# EAGLE design omni (EAGLE 9.2.0)
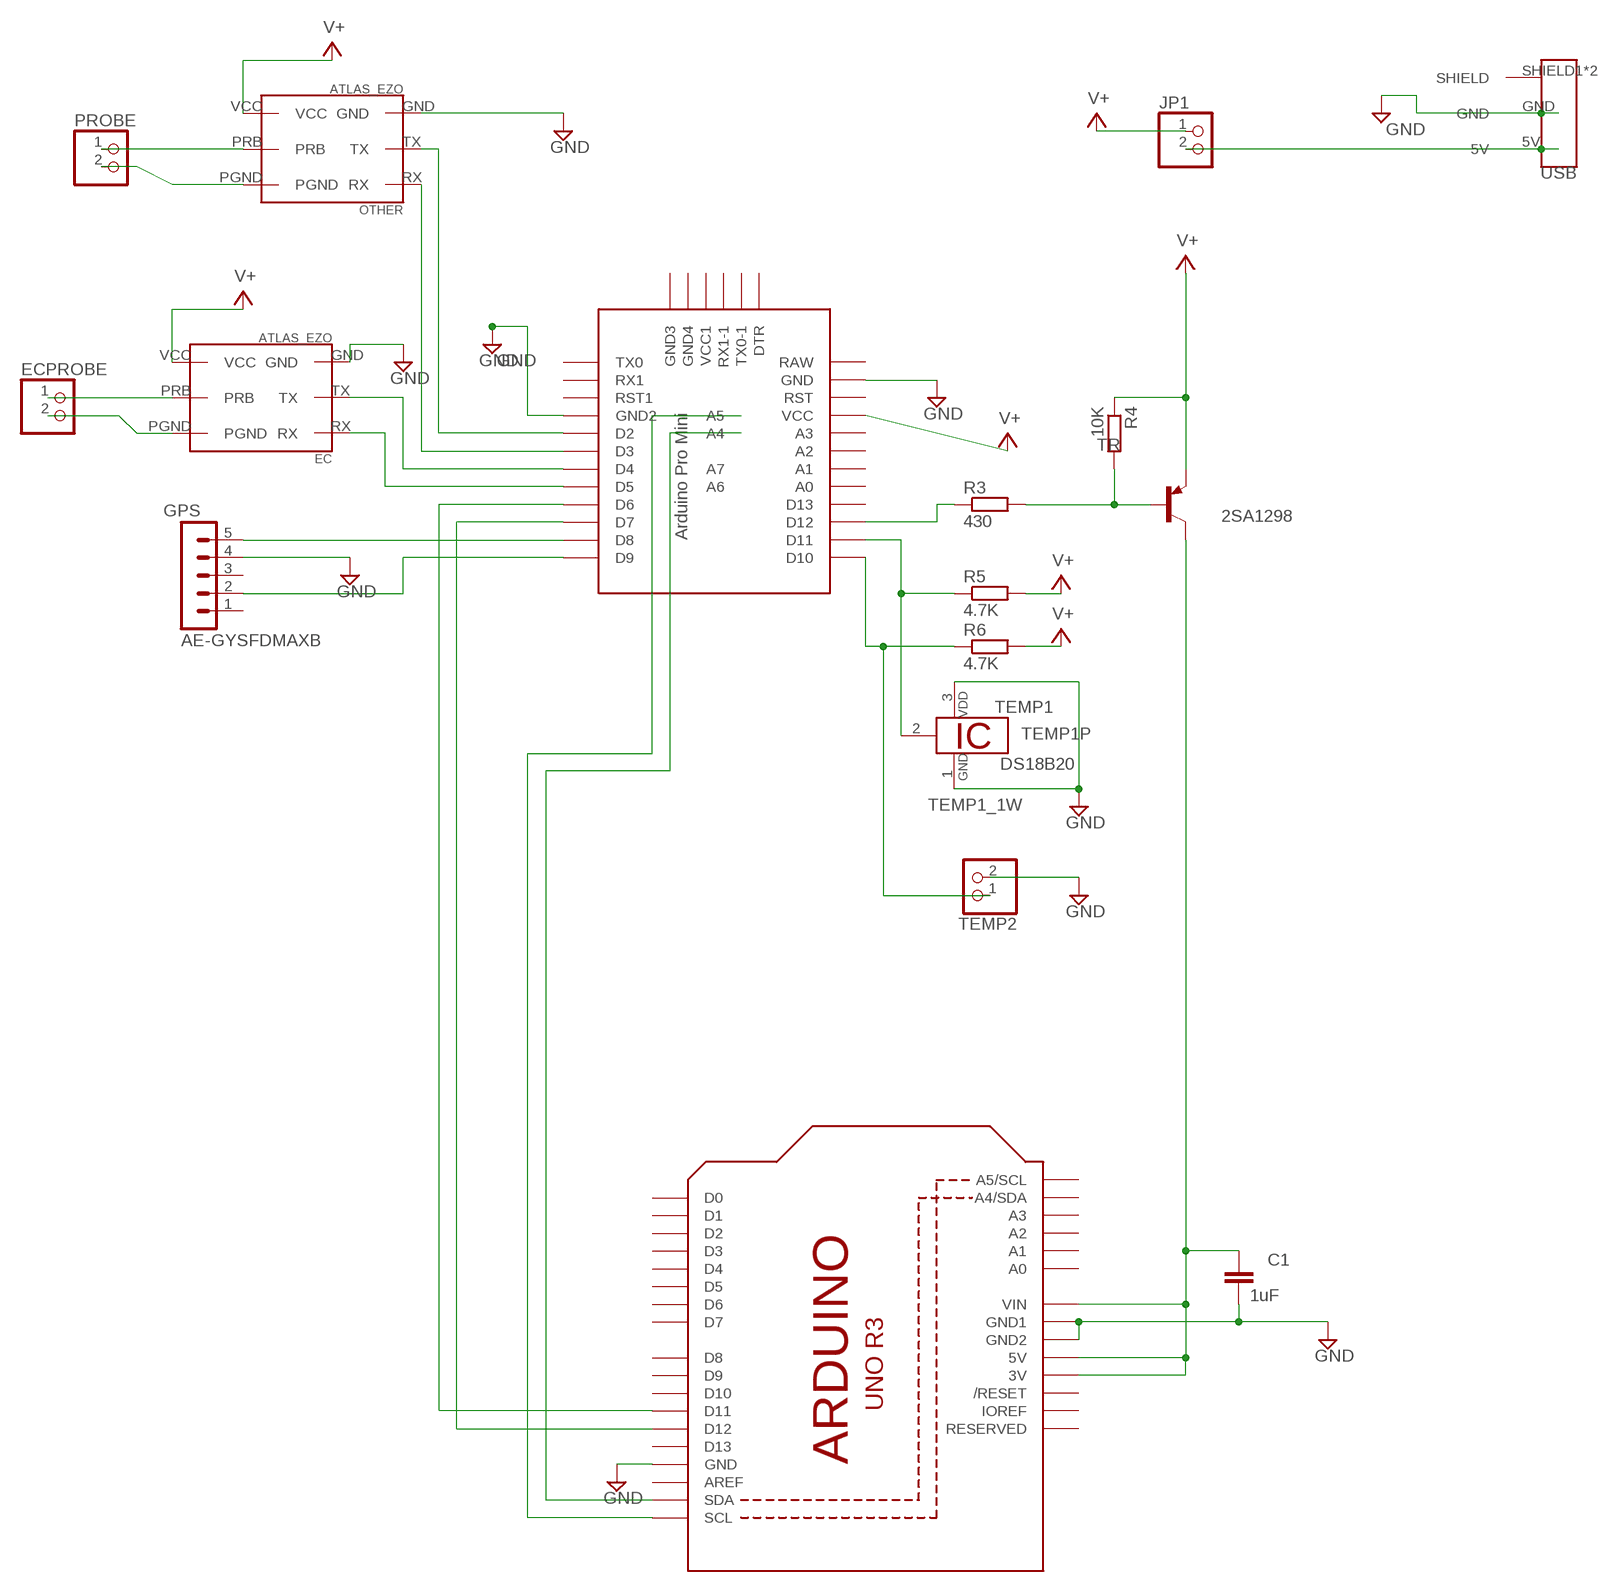
[diagram p0: schematic, sheet 1]

## Parts
C1  1uF  C-EUC2012  [C2012]
EC  ATLAS_EZO  [ATLAS_EZO]
ECPROBE  PINHD-1X2  [1X02]
GPS  AE-GYSFDMAXB  GPSAKITSUKI  [MA05-1]
JP1  PINHD-1X2  [1X02]
LTE_LORA  ARDUINOR3-BPLACE  [ARDUINOR3-BPLACE]
OTHER  ATLAS_EZO  [ATLAS_EZO]
PROBE  PINHD-1X2  [1X02]
R3  430  R-EU_M2012  [M2012]
R4  10K  R-EU_M2012  [M2012]
R5  4.7K  R-EU_M2012  [M2012]
R6  4.7K  R-EU_M2012  [M2012]
TEMP1  DS18B20  [TO92-]
TEMP2  PINHD-1X2  [1X02]
TR  2SA1298  BF823SMD  [SOT23-BEC]
U$1  PRO-MINI-2  [PRO-MINI-2]
USB  MICROUSBCON  [MICROUSBCON]

## Nets
GND: C1.2 EC.GND GPS.4(GND) LTE_LORA.GND LTE_LORA.GND1 LTE_LORA.GND2 OTHER.GND TEMP1.1 TEMP1.3 TEMP2.2 U$1.GND U$1.GND1(GND2) USB.GND
N$1: GPS.2 U$1.D9
N$2: GPS.5(5V) U$1.D8
N$3: EC.RX U$1.D5
N$4: C1.1 LTE_LORA.3V LTE_LORA.5V LTE_LORA.VIN TR.C
N$5: R3.1 U$1.D12
N$6: EC.TX U$1.D4
N$7: R3.2 R4.2 TR.B
N$8: OTHER.RX U$1.D3
N$9: R6.1 TEMP2.1 U$1.D10
N$10: R5.1 TEMP1.2 U$1.D11
N$11: OTHER.TX U$1.D2
N$12: JP1.2 USB.5V
N$13: LTE_LORA.SDA U$1.A4
N$14: LTE_LORA.SCL U$1.A5
N$15: LTE_LORA.D12 U$1.D7
N$16: LTE_LORA.D11 U$1.D6
N$17: EC.PRB ECPROBE.1
N$18: EC.PGND ECPROBE.2
N$19: OTHER.PRB PROBE.1
N$20: OTHER.PGND PROBE.2
V+: EC.VCC JP1.1 OTHER.VCC R4.1 R5.2 R6.2 TR.E U$1.VCC
Unconnected: GPS.1 GPS.3 LTE_LORA.A0 LTE_LORA.A1 LTE_LORA.A2 LTE_LORA.A3 LTE_LORA.A4(A4/SDA) LTE_LORA.A5(A5/SCL) LTE_LORA.AREF LTE_LORA.D0 LTE_LORA.D1 LTE_LORA.D2 LTE_LORA.D3 LTE_LORA.D4 LTE_LORA.D5 LTE_LORA.D6 LTE_LORA.D7 LTE_LORA.D8 LTE_LORA.D9 LTE_LORA.D10 LTE_LORA.D13 LTE_LORA.IOREF LTE_LORA.RESERVED LTE_LORA.RESET(/RESET) U$1.A0 U$1.A1 U$1.A2 U$1.A3 U$1.A6 U$1.A7 U$1.D13 U$1.DTR U$1.GND2(GND3) U$1.GND3(GND4) U$1.RAW U$1.RST U$1.RST1 U$1.RX1 U$1.RX1-1 U$1.TX0 U$1.TX0-1 U$1.VCC1 USB.SHIELD1(SHIELD) USB.SHIELD2(SHIELD)

## Library data of the parts
C1 = rcl:C-EU: CAPACITOR, European symbol; SPICEPREFIX: C
EC OTHER = AtlasScientific:ATLAS_EZO: Atlas Scientific EZO Circuit
ECPROBE JP1 PROBE TEMP2 = pinhead:PINHD-1X2: PIN HEADER
GPS = OMNI:GPSAKITSUKI: GPS MODULE; OC_FARNELL: unknown; OC_NEWARK: unknown
LTE_LORA = adafruit:ARDUINOR3: This is a new object for the new Arduino R3 - with extra pins that you may want to use (such as IOref, and duplicated A4/A5
R3-R6 = rcl:R-EU_: RESISTOR, European symbol; SPICEPREFIX: R
TEMP1 = 1wire:DS18B20: Programmable Resolution Digital Thermometer This chip provides a onewire thermosensor with approx. 0.5°C accuracy. A programmable over/undertemperure alarm is available. The precision can be set from 9..12 bits. Notes: Vdd must be applied for accurate measurements at low temperatures, as the parasite power circuit otherwise heats the sensor. If parasite power is used, Vdd has to be connected to GND. The DS1822 is a low-cost thermometer chip, the DS18S20 is similar to the DS18B20, but with 9 Bit precision only. Author: Jan Kandziora <jjj@gmx.de>
TR = transistor-pnp:BF823*: PNP Transistror
U$1 = Arduino-clone:PRO-MINI-2: Arduino Pro Mini Layout 2 Sparkfun.com
USB = OMNI:MICROUSBCON

## Board
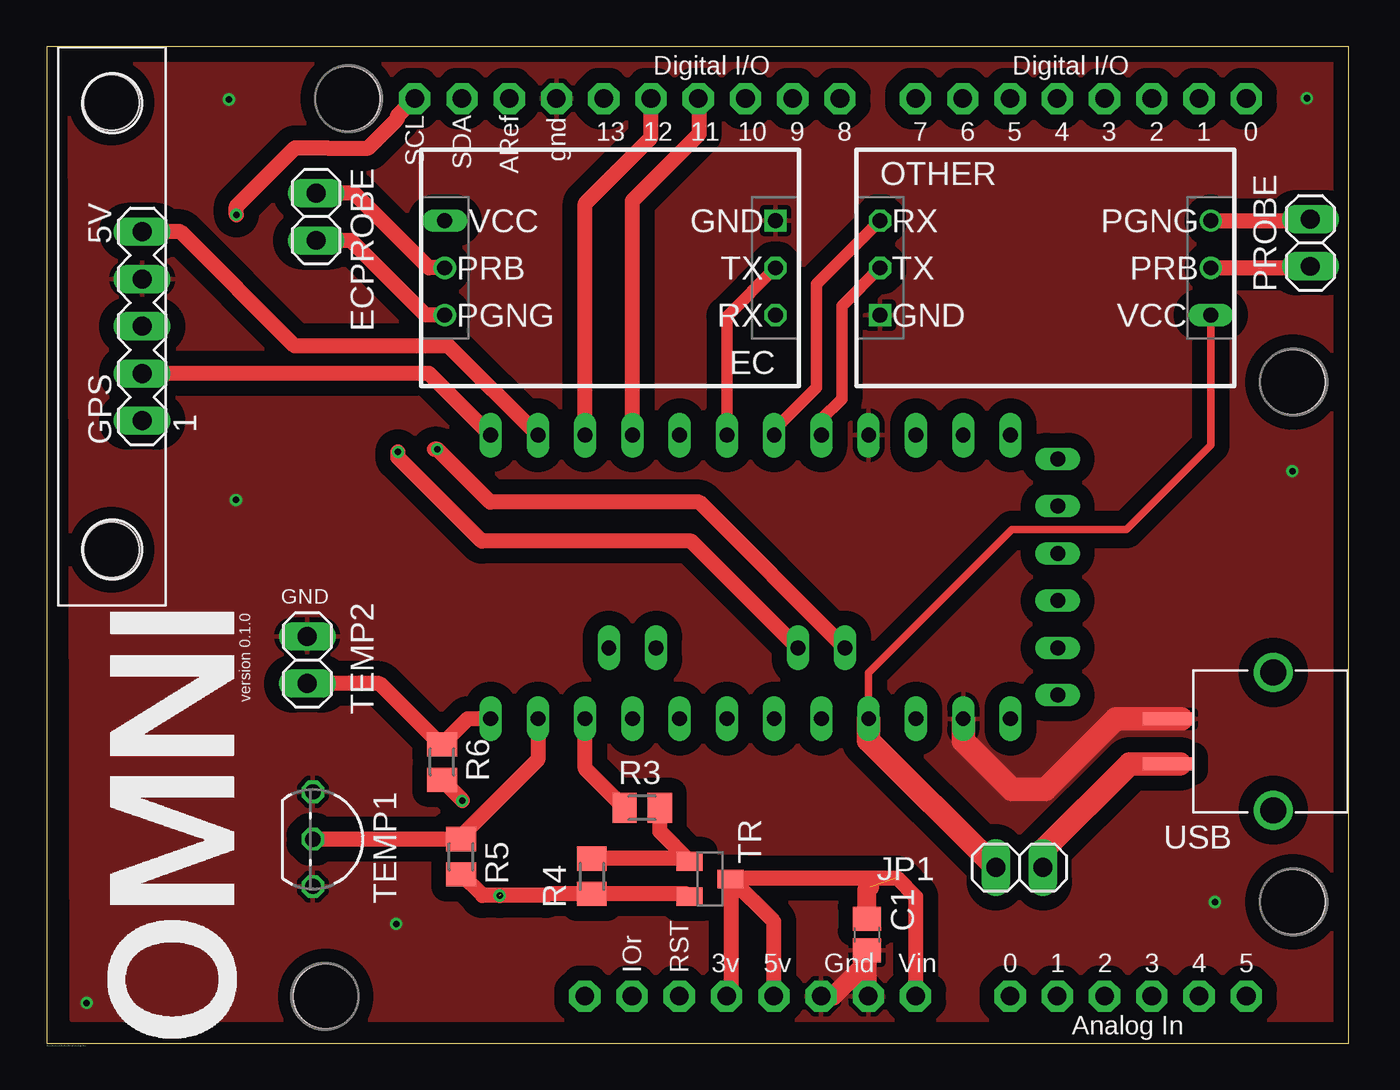
[diagram p1: board, top side]
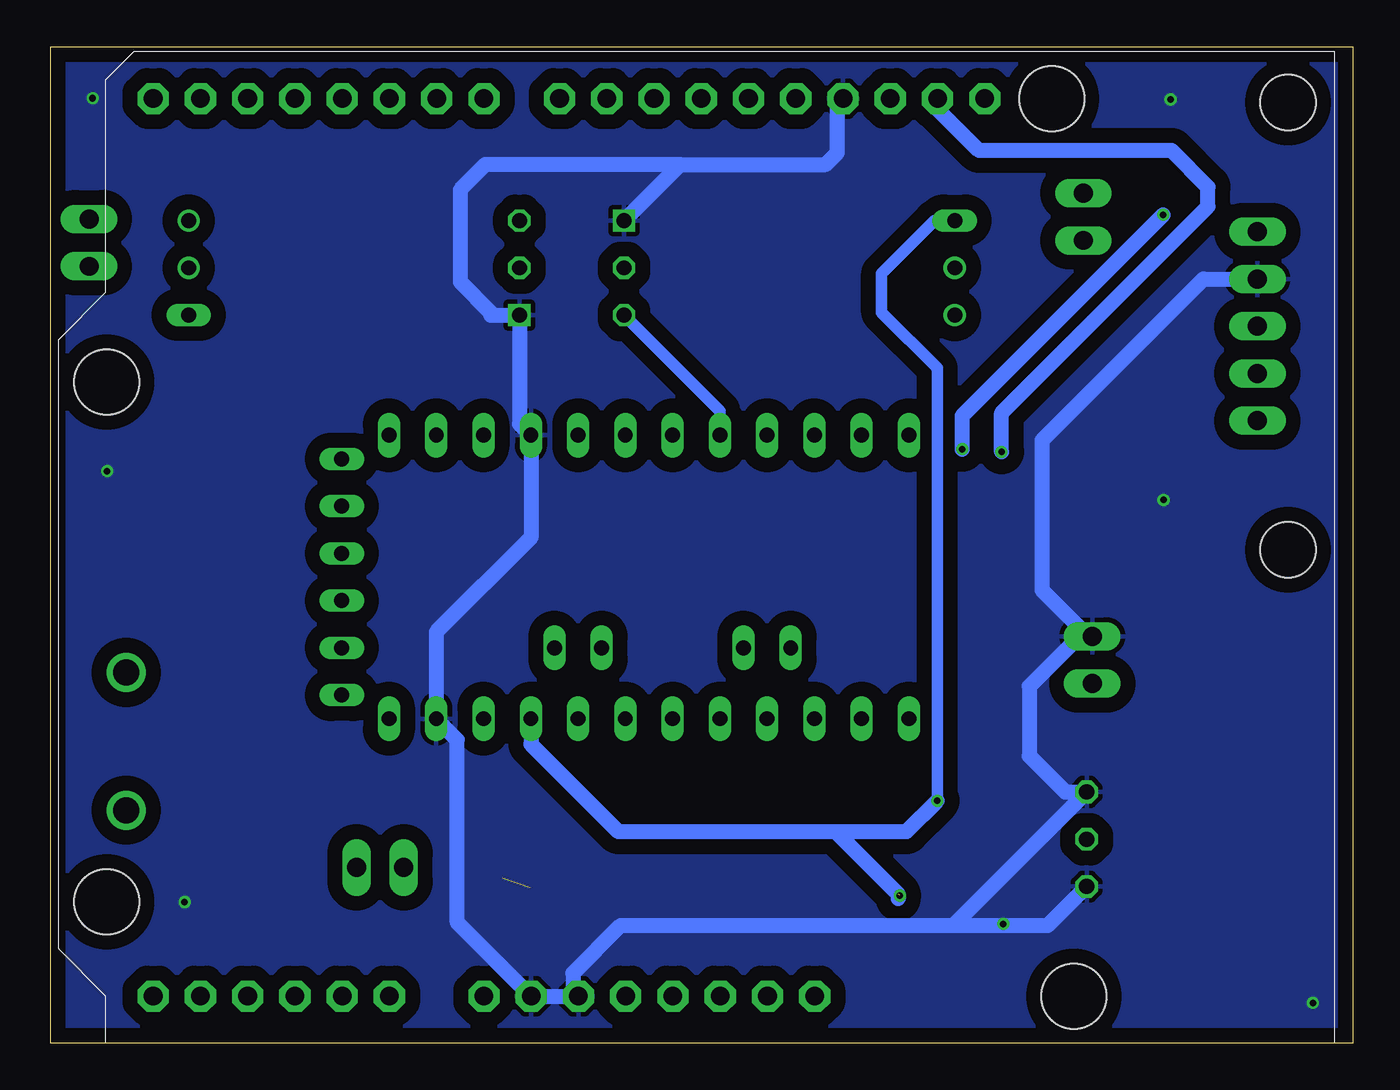
[diagram p2: board, bottom side, seen from below]

Size 70 x 53.6 mm. Coordinates in mm from the lower left corner, seen from the top.
Outline: 0,0 70,0 70,53.6 0,53.6 0,0
Copper layers (1*16): Top 0.035mm / dielectric 1.53mm / Bottom 0.035mm
Design rules "pban_4mil-l2": minimum track width 0.1mm, minimum drill 0.3mm, track to track 0.1mm, track to pad 0.229mm, pad to pad 0.1mm, via to via 0.1mm, smd to smd 0.1mm, copper to edge 0.5mm, drill to drill 0.5mm, minimum pad ring 0.15mm, minimum via ring 0.15mm, stop-mask expansion 4mil, vias tented up to drill 0.35mm, thermal gap 10mil
Holes 3.5 mm at 16.2,50.8 15,2.54 67,7.62 67,35.56
Holes 3 mm at 3.5,50.6 3.5,26.55

### Footprints (pad centres in the part's own frame; a part is rotated, then mirrored left to right if it is on the bottom)
C2012 = smd 1.3 x 1.5: 1 -0.85,0; 2 0.85,0
ATLAS_EZO = drill 0.8 square: GND -8.89,-2.54 | drill 0.8: PGND 8.89,2.54; PRB 8.89,0 | drill 0.8 octagon: RX -8.89,2.54; TX -8.89,0 | drill 0.8 long: VCC 8.89,-2.54
1X02 = drill 1.016 long: 1 -1.27,0; 2 1.27,0
MA05-1 = drill 1.016 long: 1 -5.08,0; 2 -2.54,0; 3 0,0; 4 2.54,0; 5 5.08,0
ARDUINOR3-BPLACE = drill 1 pad 1.676 octagon: 3V 35.56,2.54; 5V 38.1,2.54; A0 50.8,2.54; A1 53.34,2.54; A2 55.88,2.54; A3 58.42,2.54; A4 60.96,2.54; A5 63.5,2.54; AREF 23.876,50.8; D0 63.5,50.8; D1 60.96,50.8; D2 58.42,50.8; D3 55.88,50.8; D4 53.34,50.8; D5 50.8,50.8; D6 48.26,50.8; D7 45.72,50.8; D8 41.656,50.8; D9 39.116,50.8; D10 36.576,50.8; D11 34.036,50.8; D12 31.496,50.8; D13 28.956,50.8; GND 26.416,50.8; GND1 43.18,2.54; GND2 40.64,2.54; IOREF 30.48,2.54; RESERVED 27.94,2.54; RESET 33.02,2.54; SCL 18.796,50.8; SDA 21.336,50.8; VIN 45.72,2.54
M2012 = smd 1.3 x 1.6: 1 -0.95,0; 2 0.95,0
TO92- = drill 0.813 octagon: 1 -2.54,0; 2 0,0; 3 2.54,0
SOT23-BEC = smd 1 x 1.4: B -0.95,-1.1; C 0,1.1; E 0.95,-1.1
PRO-MINI-2 = drill 0.8 long: A0 6.35,2.54; A1 6.35,0; A2 6.35,-2.54; A3 6.35,-5.08; A4 2.54,1.27; A5 2.54,3.81; A6 2.54,-8.89; A7 2.54,-6.35; D2 -8.89,2.54; D3 -8.89,0; D4 -8.89,-2.54; D5 -8.89,-5.08; D6 -8.89,-7.62; D7 -8.89,-10.16; D8 -8.89,-12.7; D9 -8.89,-15.24; D10 6.35,-15.24; D11 6.35,-12.7; D12 6.35,-10.16; D13 6.35,-7.62; DTR 5.08,15.24; GND 6.35,10.16; GND1 -8.89,5.08; GND2 -7.62,15.24; GND3 -5.08,15.24; RAW 6.35,12.7; RST 6.35,7.62; RST1 -8.89,7.62; RX1 -8.89,10.16; RX1-1 0,15.24; TX0 -8.89,12.7; TX0-1 2.54,15.24; VCC 6.35,5.08; VCC1 -2.54,15.24
MICROUSBCON = smd 0.7 x 2.7: 5V 1.2,-1.35; GND -1.2,-1.35 | drill 1.4: SHIELD1 -3.7,4.3; SHIELD2 3.7,4.3

### Placement (x,y rotation side)
C1  44.1,5.85 270 top
EC  30.3,41.7 180 top
ECPROBE  14.49,44.45 270 top
GPS  5.14,38.56 90 top
JP1  52.3,9.46 0 top
LTE_LORA  1,0 0 top
OTHER  53.7,41.7 0 top
PROBE  67.95,43.05 90 top
R3  32.02,12.67 0 top
R4  29.32,8.99 90 top
R5  22.29,10.04 270 top
R6  21.26,15.13 270 top
TEMP1  14.32,10.98 270 top
TEMP2  14.02,20.62 90 top
TR  35.67,8.84 270 top
U$1  39.12,23.81 270 top
USB  61.65,16.24 270 top

### Tracks (layer width: path | path; a pad name or v marks a point on that pad's centre or on a via)
GND  (via drill 0.35)
  Top 1.016: LTE_LORA.GND1 44.1,2.62 C1.2 44.1,4.35 42.29,2.54 LTE_LORA.GND2
  Top 1.27: U$1.GND 49.28,16.27 51.9,13.65 53.7,13.65 57.49,17.44 USB.GND 61.01,17.44
  Bottom 0.813: 44.45,2.54 LTE_LORA.GND1 | LTE_LORA.GND 27.72,50.5 27.72,47.88 28.35,47.25 36.18,47.25 | TEMP1.3 16.41,6.35 21.49,6.35 | 21.49,6.35 39.37,6.35 41.94,3.78 41.94,2.84 LTE_LORA.GND2 LTE_LORA.GND1 | GPS.4 8.04,41.1 16.72,32.42 16.72,24.37 14.32,21.97 14.32,21.89 TEMP2.2 14.71,21.89 17.4,19.2 17.4,15.45 15.47,13.52 TEMP1.1 21.49,6.35 | 36.18,47.25 EC.GND | 36.18,47.25 46.65,47.25 48,45.9 48,40.95 46.35,39.3 46.35,39.15 OTHER.GND 44.81,33.31 U$1.GND1 44.2,27.2 49.28,22.12 U$1.GND 48.15,16.33 48.15,6.51 LTE_LORA.GND1
  other vias: 18.8,6.42 9.81,50.75 10.18,29.22 2.15,2.18 62.81,7.6 66.98,30.77 67.76,50.82
  pour Top (isolate 0.8): 69.15,52.97 69.4,52.72 69.4,1.27 1.36,1.27 1.24,52.97
  pour Bottom (isolate 0.8): 0.67,53.04 69.24,53.04 69.63,52.65 69.63,0.96 69.34,0.67 0.77,0.67 0.67,0.77
N$1
  Top 0.813: GPS.2 6.3,36.02 8.23,36.02 20.56,36.02 U$1.D9
N$2
  Top 0.813: U$1.D8 21.62,37.5 13.35,37.5 7.21,43.64 GPS.5
N$3
  Bottom 0.61: EC.RX 34.04,34.01 U$1.D5
N$4  (1 unrouted)
  Top 0.813: LTE_LORA.3V 36.83,2.81 36.83,8.83 | 36.77,8.89 TR.C | 36.77,8.89 45.72,8.89 46.72,7.89 LTE_LORA.VIN | 36.83,8.83 36.77,8.89 | 36.83,8.83 39.1,6.56 LTE_LORA.5V
  Top 1.016: C1.1 44.1,8.25 44.25,8.4
N$5
  Top 0.813: R3.1 28.96,14.78 U$1.D12
N$6
  Top 0.61: EC.TX 36.58,39.09 U$1.D4
N$7
  Top 0.813: R3.2 32.97,11.39 TR.B 34.42,9.94 R4.2
N$8
  Top 0.61: OTHER.RX 41.4,40.83 41.4,35.25 39.12,32.97 U$1.D3
N$9
  Top 0.813: TEMP2.1 17.9,19.35 21.17,16.08 R6.1 22.65,17.46 U$1.D10 23.56,17.46
N$10
  Top 0.813: 22.29,11.13 R5.1 | TEMP1.2 22.14,10.98 22.29,11.13 | U$1.D11 26.42,15.26 22.29,11.13
N$11
  Top 0.61: OTHER.TX 42.75,39.64 42.75,34.65 41.66,33.56 U$1.D2
N$12
  Top 1.27: JP1.2 53.57,10.37 58.24,15.04 USB.5V 60.94,15.04
N$13  (via drill 0.35)
  Top 0.813: U$1.A4 34.66,27 23.4,27 18.9,31.5 v18.9,31.8
  Bottom 0.813: v18.9,31.8 18.9,33.9 7.8,45 7.8,46.05 9.75,48 20.1,48 22.34,50.24 LTE_LORA.SDA
N$14  (via drill 0.35)
  Top 0.813: U$1.A5 35.1,29.1 23.85,29.1 v21,31.95 20.85,31.95 | v10.2,44.55 10.2,45 13.36,48.16 15.09,48.16 15.1,48.14 17.3,48.14 18.86,49.7 18.86,49.86 LTE_LORA.SCL
  Bottom 0.813: v21,31.95 21,33.75 v10.2,44.55
N$15
  Top 0.813: U$1.D7 28.96,45.16 32.5,48.7 LTE_LORA.D12
N$16
  Top 0.813: U$1.D6 31.5,45.3 35.1,48.9 35.1,50.74 LTE_LORA.D11
N$17
  Top 0.813: EC.PRB 20.55,41.7 16.54,45.72 ECPROBE.1
N$18
  Top 0.813: EC.PGND 20.39,39.16 16.38,43.17 ECPROBE.2
N$19
  Top 0.813: OTHER.PRB 67.87,41.7 PROBE.1
N$20
  Top 0.813: OTHER.PGND 67.87,44.24 PROBE.2
V+  (via drill 0.35)  (1 unrouted)
  Top 0.406: U$1.VCC 44.2,19.93 51.91,27.64 58.05,27.64 62.59,32.18 OTHER.VCC
  Top 0.813: TR.E 34.42,8.04 R4.1 26.94,8.04 26.85,7.95 v24.36,7.95 23.43,7.95 R5.2 | 21.26,14.13 R6.2 22.35,13.09 v22.35,13.05
  Top 1.27: JP1.1 44.2,16.29 U$1.VCC
  Bottom 0.61: v22.35,13.05 22.35,36.3 25.35,39.3 25.35,41.4 22.51,44.24 EC.VCC
  Bottom 0.813: U$1.VCC 44.2,16.09 39.51,11.4 27.82,11.4 | 24.44,7.8 24.44,8.02 27.82,11.4 | 27.82,11.4 24,11.4 v22.35,13.05

### Text on the board
tPlace: version 0.1.0 | /Users/yamamoto/Dropbox/design/omni/logo.bmp
tNames: GND